# Altium schematic sheet Input_Stage.SchDoc
size A; SheetNumber: 2; SheetTotal: 4
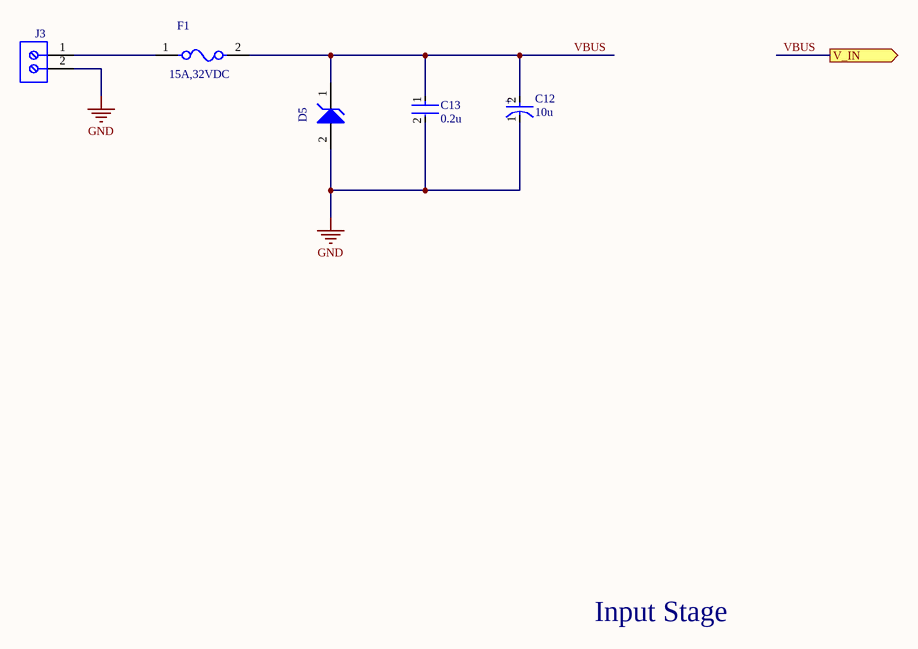
[diagram p0: Input_Stage.SchDoc]

## Parts
C12  10u  [FP-RAD-TH-D_10_0_5-L_16_1-MFG]
C13  0.2u  [FP-C0805C-DN-MFG]
D5  824540301  [WE-TVSP_DO-214AB_Unidirectional]  (value not drawn)
F1  15A,32VDC  [FP-SF-1206HHA-R-MFG]
J3  691134710002  [691134710002]  (value not drawn)

## Ports
V_IN (out, see Battery_Charger[2B], LTC4020_Controller[1A], Switching_Bridge[1B])

## Nets
GND: C12.1(C) C13.2 D5.2(A) J3.2
VBUS: C12.2(A) C13.1 D5.1(K) F1.2 ; port V_IN
NetF1_1: F1.1 J3.1

## Notes on the sheet
- Input Stage
- (in symbol CMP-05427-000510-1) +

## Library data of the parts
C12 = CMP-05427-000510-1: Aluminum Electrolytic Capacitors (Radial Lead Type) AEC-Q200 Qualified 820uF ±20% 10V; ESR (Equivalent Series Resistance): 68mR; Ripple Current: 1.05A; Lead Diameter: 0.6mm; Dielectric Material: Aluminium; Leakage Current: 3uA; Life (Hours): 3000Hour; Package Quantity: 200; Construction: RADIAL; Radiation Hardening: No; Voltage Rating: 10V; Height - Seated (Max): 0.63inch; Case/Package: Radial; Lead Free: Lead Free; Voltage Rating (DC): 10V; Voltage: 10V; RoHS Compliant: Yes; Max Operating Temperature: 105°C; Number of Pins: 2; Impedance: 68mR; Length: 16mm; REACH SVHC: No SVHC; Lead Pitch: 5mm; Termination: Radial; Mount: Through Hole; Capacitance: 820uF; Min Operating Temperature: -55°C; Diameter: 10mm; Height: 16mm; Ripple Current (AC): 1.05A; Series: FC; Packaging: Bulk; Tolerance: 20%
C13 = CMP-2007-00279-2: CAP CER 0.1UF 50V X7R 0805; Manufacturer Part Number: C0805C104K5RACTU; Manufacturer: KEMET; Value: 0.10 μF; Tolerance: 0.1; Temperature Coefficient: 30ppm/°C; Material: Ceramic; Device Class L2: Capacitors; Temperature Range Low: -55°C; Voltage Rating: 50 V; Digikey Description: CAP CER 0.1UF 50V X7R 0805; Category: Cap; ComponentLink2Description: Datasheet; Octopart: https://octopart.com/c0805c104k5ractu-kemet-143926; RoHS: TRUE; ComponentLink2URL: https://content.kemet.com/datasheets/KEM_C1003_C0G_SMD.pdf; Temperature Characteristic: X7R; Temperature: -55°C to +125°C; Height: 0.88mm; Temperature Range High: +125°C; Device Class L1: Passive Components; Automotive: No; Lead Free: Yes; Ipc Land Pattern Name: CAPC200125X78; Device Class L3: Ceramic Capacitors; Mouser Description: Cap Ceramic 0.1uF 50V X7R 10% SMD 2.0 x 1.2 mm 125 C Paper T/R; Capacitance: 0.10 μF; Package: C0805C-DN
D5 = CMP-03913-71101661-2: Tvs Diode, 1.5KW, 30V, Unidir, DO-214AB; Peak Pulse Current: 31A; Number of Unidirectional Channels: 1; Breakdown Voltage: 35.05V; Clamping Voltage: 48.4V; Polarity: Unidirectional; Power Line Protection: No; Leakage Current: 1µA; Peak Pulse Power: 1.5kW; RoHS: Compliant; Length: 6.86mm; Max Operating Temperature: 150°C; Number of Pins: 2; Max Breakdown Voltage: 35.05V; Packaging: Cut Tape; REACH SVHC: Unknown; Width: 5.91mm; Min Operating Temperature: -65°C; Reverse Standoff Voltage: 30V; Composition: Zener; Mount: Surface Mount; Height: 2.5mm; Min Breakdown Voltage: 35.05V
F1 = CMP-00059-142019744-1: SF-1206HHA1500R-2 Fuse Chip 15A 50V SMD Solder Pad 1206 3.2 X 1.65 X 1mm; Resistance: 2.6mΩ; Min Operating Temperature: -55°C; Case/Package: 1206; Height: 1.2mm; Max Operating Temperature: 125°C; Fuse Current: 15A; Voltage Rating: 50V; NexarPartId: 142019744
J3 = CMP-1502-03295-3: Wire-To-Board Terminal Block, 5mm Pitch, Horizontal, Screw, 2 Poles